# EAGLE design LampSchematic_movergb (EAGLE 7.3.0)
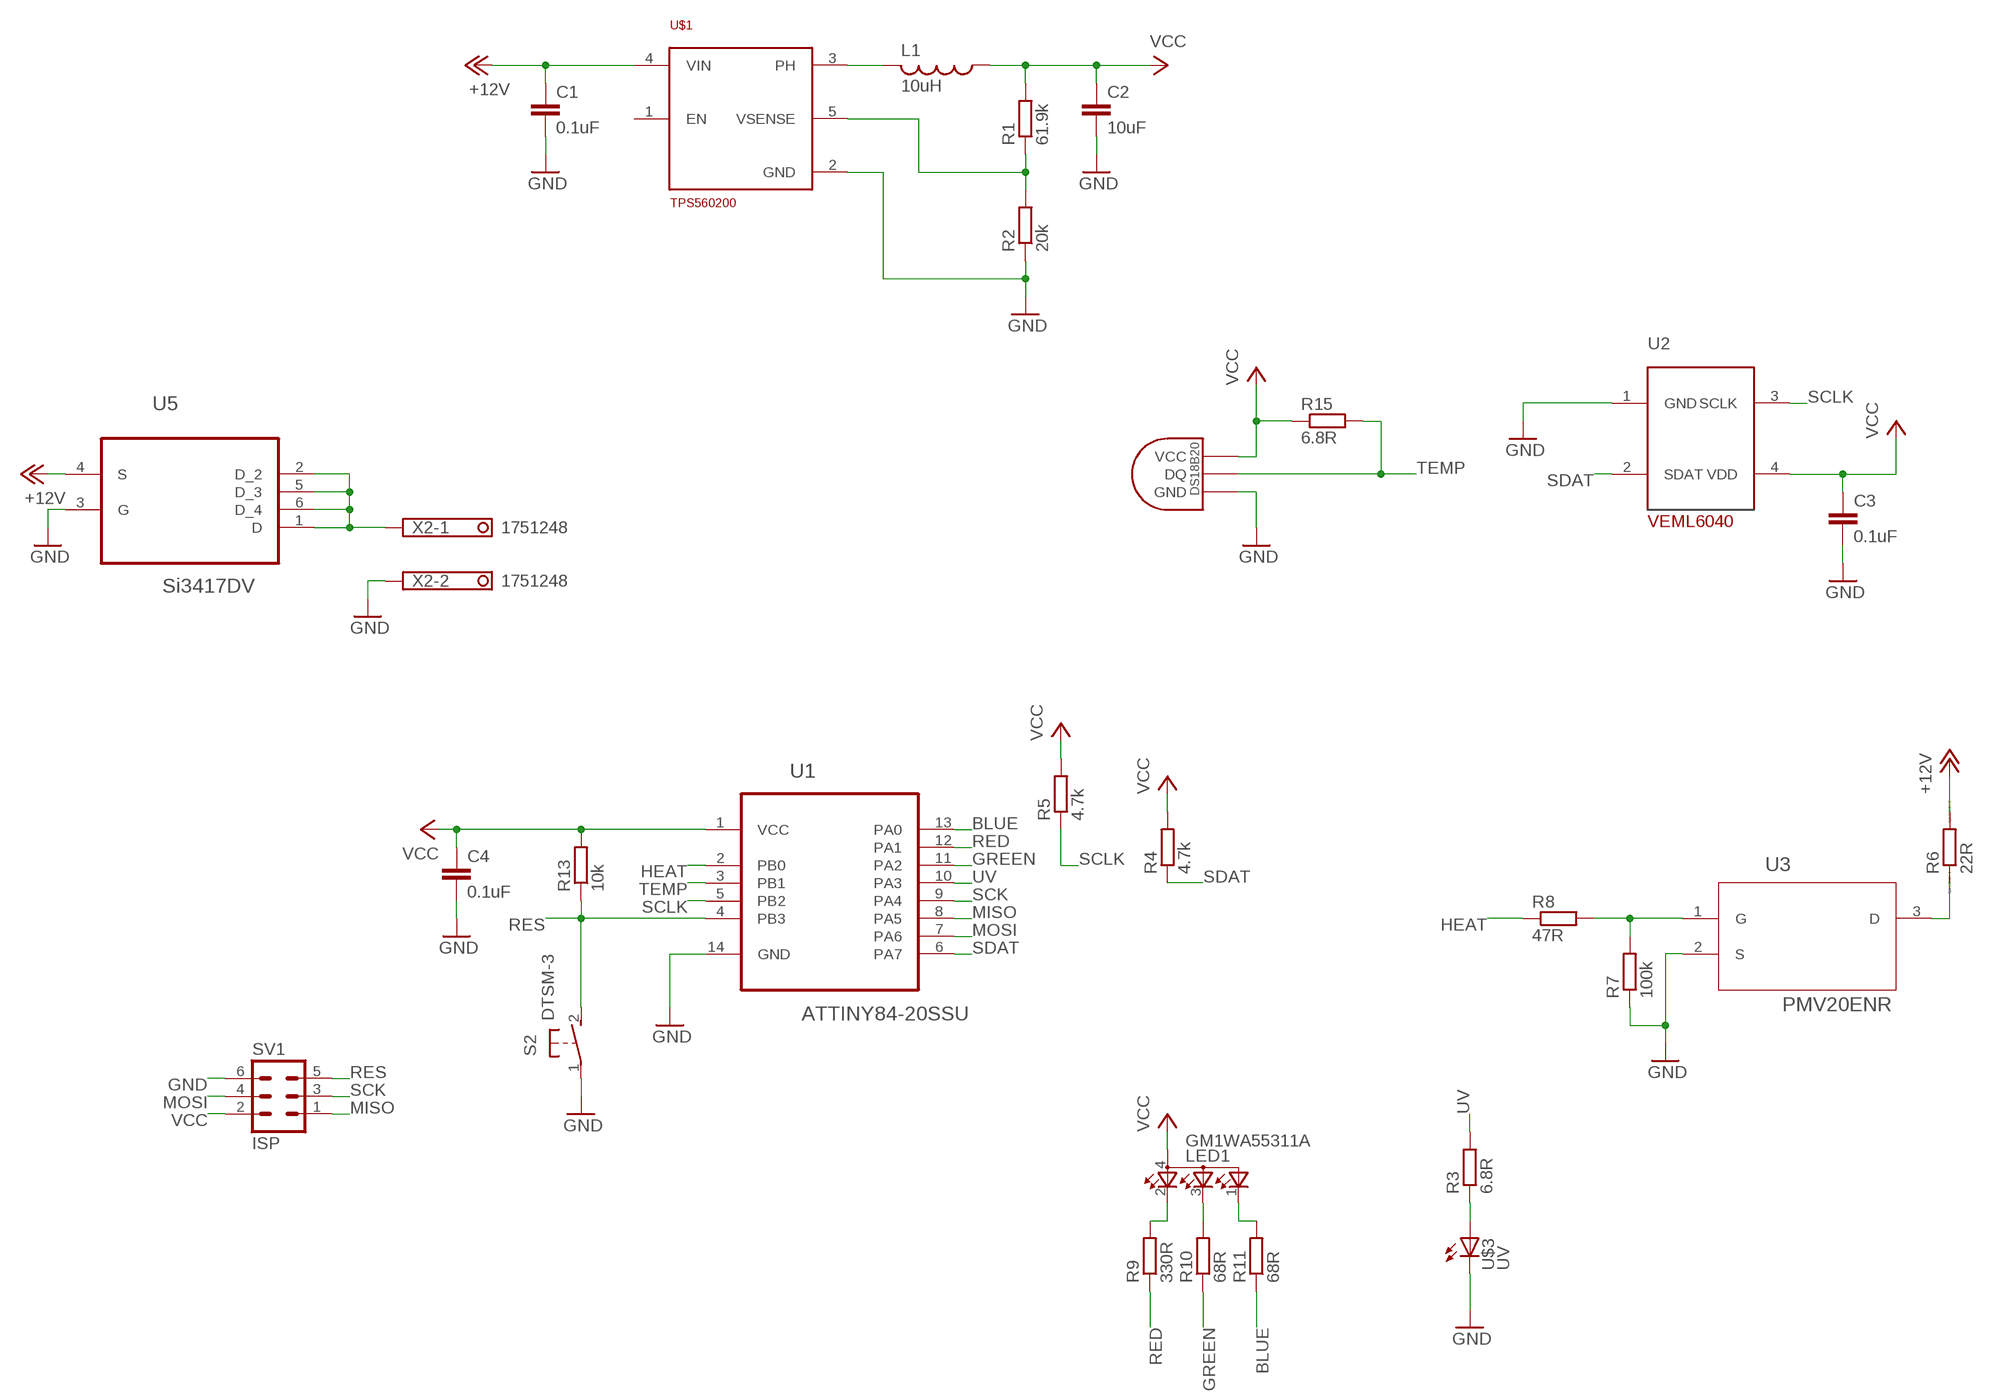
[diagram p0: schematic, sheet 1]

## Parts
C1  0.1uF  C-EUC0805  [C0805]
C2  10uF  C-EUC0805  [C0805]
C3  0.1uF  C-EUC0805  [C0805]
C4  0.1uF  C-EUC0805  [C0805]
L1  10uH  L-USL2012C  [L2012C]
LED1  GM1WA55311A  [GM1WA55311A]
R1  61.9k  R-EU_R0805  [R0805]
R2  20k  R-EU_R0805  [R0805]
R3  6.8R  R-EU_R0805  [R0805]
R4  4.7k  R-EU_R0805  [R0805]
R5  4.7k  R-EU_R0805  [R0805]
R6  22R  R  [5WRESISTOR]
R7  100k  R-EU_R0805  [R0805]
R8  47R  R-EU_R0805  [R0805]
R9  330R  R-EU_R0805  [R0805]
R10  68R  R-EU_R0805  [R0805]
R11  68R  R-EU_R0805  [R0805]
R13  10k  R-EU_R0805  [R0805]
R15  6.8R  R-EU_R0805  [R0805]
S2  DTSM-3  [DTSM-3]
SV1  ISP  MA03-2  [MA03-2]
U1  ATTINY84-20SSU  [SOIC127P600X175-14N]
U2  VEML6040  [VEML6040]
U3  PMV20ENR  [SOT95P230X110-3N]
U5  Si3417DV  SI3417DV-T1-GE3  [SOP95P285X110-6N]
U$1  TPS560200  [SOT23-5L]
U$2  DS1820TO92  [DS1820]
U$3  UV  [GM5BW96385A]
X2  1751248  [1751248]

## Nets
+12V: C1.1 R6.P$2 U5.4(S) U$1.4(VIN)
BLUE: R11.1 U1.13(PA0)
GND: C1.2 C2.2 C3.2 C4.2 R2.1 R7.1 S2.1 SV1.6 U1.14(GND) U2.1(GND) U3.2(S) U5.3(G) U$1.2(GND) U$2.GND U$3.2 X2.2
GREEN: R10.1 U1.11(PA2)
HEAT: R8.1 U1.2(PB0)
MISO: SV1.1 U1.8(PA5)
MOSI: SV1.4 U1.7(PA6)
N$1: L1.2 U$1.3(PH)
N$2: R1.1 R2.2 U$1.5(VSENSE)
N$4: R6.P$1 U3.3(D)
N$5: R7.2 R8.2 U3.1(G)
N$6: LED1.2(CRED) R9.2
N$7: LED1.3(CBLUE) R10.2
N$8: LED1.1(CGREEN) R11.2
N$9: R3.1 U$3.1
N$11: U5.1(D) U5.2(D_2) U5.5(D_3) U5.6(D_4) X2.1
RED: R9.1 U1.12(PA1)
RES: R13.1 S2.2 SV1.5 U1.4(PB3)
SCK: SV1.3 U1.9(PA4)
SCLK: R5.1 U1.5(PB2) U2.3(SCLK)
SDAT: R4.1 U1.6(PA7) U2.2(SDAT)
TEMP: R15.2 U1.3(PB1) U$2.DQ
UV: R3.2 U1.10(PA3)
VCC: C2.1 C3.1 C4.1 L1.1 LED1.4(A) R1.2 R4.2 R5.2 R13.2 R15.1 SV1.2 U1.1(VCC) U2.4(VDD) U$2.VDD(VCC)
Unconnected: U$1.1(EN)

## Library data of the parts
C1-C4 = resistor:C-EU: CAPACITOR, European symbol
L1 = resistor:L-US: INDUCTOR, American symbol
LED1 = MyParts:GM1WA55311A: Chip LED RGB Source: http://document.sharpsma.com/files/GM1WA55311A_SS.pdf
R1-R5 R7-R11 R13 R15 = resistor:R-EU_: RESISTOR, European symbol
R6 = MyParts:R
S2 = switch-tact:DTSM-3
SV1 = con-lstb:MA03-2: PIN HEADER; OC_FARNELL: unknown; OC_NEWARK: unknown
U1 = Atmel_By_element14_Batch_1-00:ATTINY84-20SSU: 8-bit Microcontroller with Bytes In-System Programmable Flash; MPN: ATTINY84-20SSU; OC_FARNELL: 1636955; OC_NEWARK: 03P2040; PACKAGE: SOIC-14; SUPPLIER: Atmel
U2 = MyParts:VEML6040: VEML6040 Selectable maximum detection range (360, 721, 1442, 2883, 5767, or 11 796) lux with highest sensitivity 0.0056 lux/step. Temperature compensation: -40 °C to +85 °C Operation voltage: 2.5 V to 3.6 V.
U3 = MyParts:PMV20ENR
U5 = MyParts:SI3417DV-T1-GE3: Id - Continuous Drain Current: 8 A Vds - Drain-Source Breakdown Voltage: - 30 V Rds On - Drain-Source Resistance: 30 mOhms Transistor Polarity: P-Channel Vgs - Gate-Source Breakdown Voltage: 20 V
U$1 = MyParts:TPS560200
U$2 = Ava:DS1820: DS18B20 Programmable Resolution 1-Wire Digital Thermometer Description The DS18B20 digital thermometer provides 9-bit to 12-bit Celsius temperature measurements and has an alarm function with nonvolatile user-programmable upper and lower trigger points. The DS18B20 communicates over a 1-Wire® bus that by definition requires only one data line (and ground) for communication with a central microprocessor. It has an operating temperature range of -55°C to +125°C and is accurate to ±0.5°C over the range of -10°C to +85°C. In addition, the DS18B20 can derive power directly from the data line ("parasite power"), eliminating the need for an external power supply. Each DS18B20 has a unique 64-bit serial code, which allows multiple DS18B20s to function on the same 1-Wire bus. Thus, it is simple to use one microprocessor to control many DS18B20s distributed over a large area. Applications that can benefit from this feature include HVAC environmental controls, temperature monitoring systems inside buildings, equipment, or machinery, and process monitoring and control systems.
U$3 = MyParts:UV
X2 = con-phoenix-350:1751248: MKDS 1/ 2-3,5 Printklemme Nennstrom: 10 A Bemessungsspannung: 160 V Raster: 3,5 mm Polzahl: 2 Montageart: Löten Anschlussart: Schraubanschluss Anschlussrichtung vom Leiter zur Platine: 0° Source: http://eshop.phoenixcontact.com .. 1751248.pdf; OC_FARNELL: unknown; OC_NEWARK: unknown

## Board
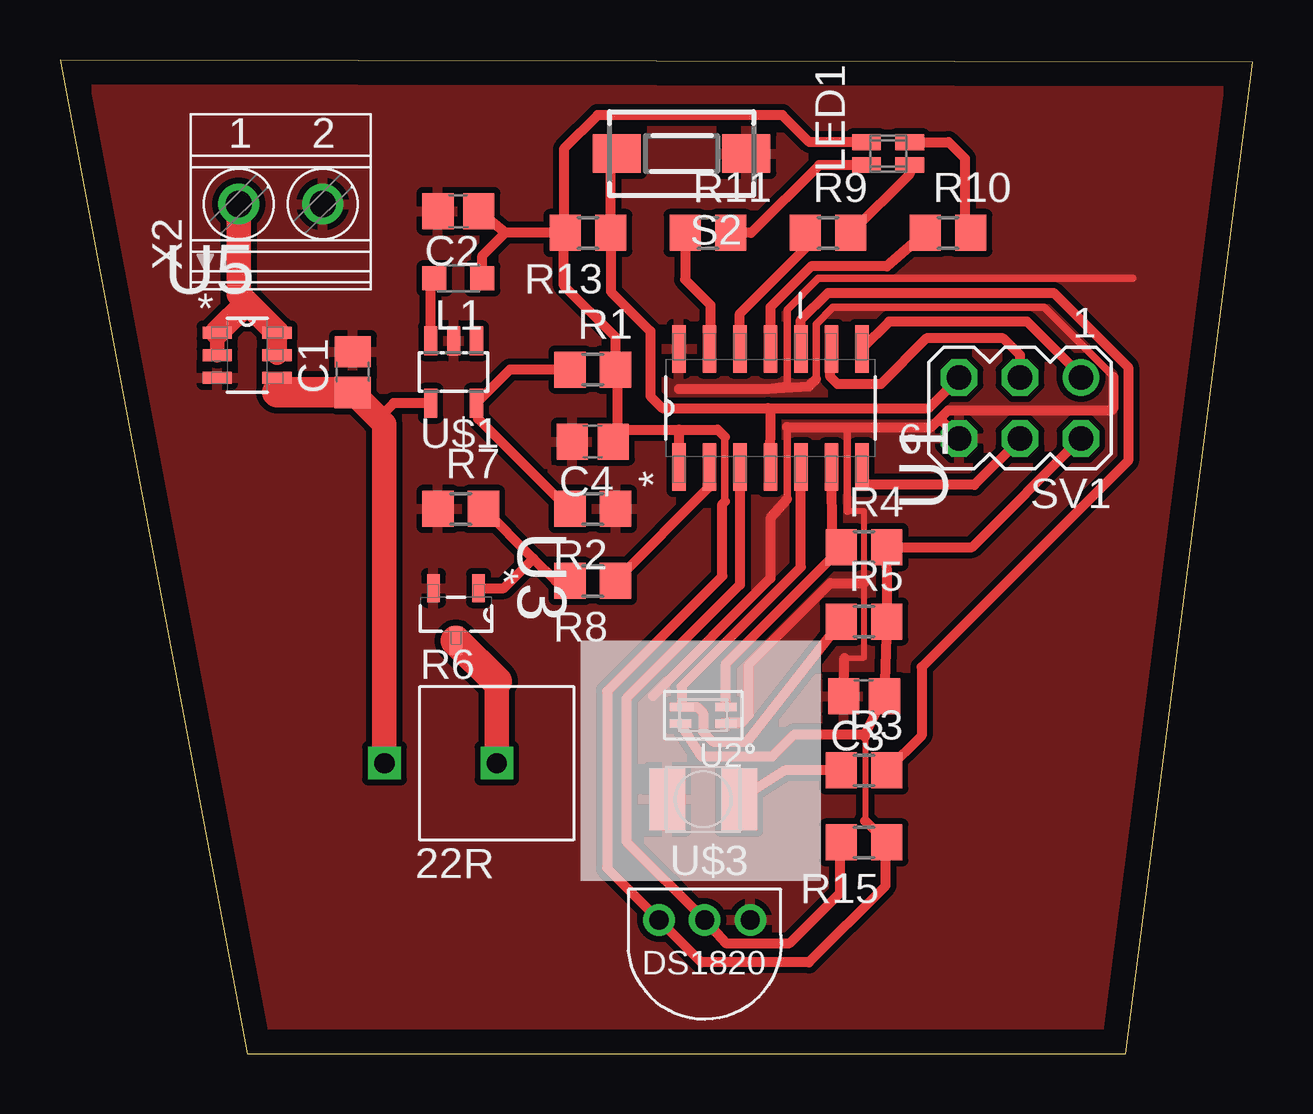
[diagram p1: board, top side]

Size 49.7 x 41.4 mm. Coordinates in mm from the lower left corner, seen from the top.
Outline: 7.8,0 44.4,0 49.7,41.3 0,41.4 7.8,0
Copper layers (1*16): Top 0.035mm / dielectric 1.5mm / Bottom 0.035mm
Design rules "default": minimum track width 10mil, minimum drill 24mil, track to track 8mil, track to pad 8mil, pad to pad 8mil, via to via 8mil, smd to smd 8mil, copper to edge 40mil, drill to drill 8mil, minimum pad ring 10mil, minimum via ring 8mil, stop-mask expansion 4mil, vias tented up to drill 0mil, thermal gap 10mil

### Footprints (pad centres in the part's own frame; a part is rotated, then mirrored left to right if it is on the bottom)
C0805 = smd 1.3 x 1.5: 1 -0.85,0; 2 0.85,0
L2012C = smd 1 x 1: 1 -1,0; 2 1,0
GM1WA55311A = smd 0.65 x 1.2: 1 -0.475,0.9; 2 -0.475,-0.9; 3 0.475,-0.9; 4 0.475,0.9
R0805 = smd 1.3 x 1.5: 1 -0.95,0; 2 0.95,0
5WRESISTOR = drill 0.85 square: P$1 0,0; P$2 -4.68,0
DTSM-3 = smd 2 x 1.6: 1 -2.7,0; 2 2.7,0
MA03-2 = drill 1.016: 1 -2.54,-1.27 | drill 1.016 octagon: 2 -2.54,1.27; 3 0,-1.27; 4 0,1.27; 5 2.54,-1.27; 6 2.54,1.27
SOIC127P600X175-14N = smd 1.981 x 0.559: 1 -2.464,3.81; 2 -2.464,2.54; 3 -2.464,1.27; 4 -2.464,0; 5 -2.464,-1.27; 6 -2.464,-2.54; 7 -2.464,-3.81; 8 2.464,-3.81; 9 2.464,-2.54; 10 2.464,-1.27; 11 2.464,0; 12 2.464,1.27; 13 2.464,2.54; 14 2.464,3.81
VEML6040 = smd 0.9 x 0.35: 1 -0.95,0.35; 2 -0.95,-0.35; 4 0.95,0.35 | smd 1 x 0.35: 3 0.9,-0.35
SOT95P230X110-3N = smd 1.168 x 0.533: 1 -1.092,0.94; 2 -1.092,-0.94; 3 1.092,0
SOP95P285X110-6N = smd 1.219 x 0.508: 1 -1.245,0.94; 2 -1.245,0; 3 -1.245,-0.94; 4 1.245,-0.94; 5 1.245,0; 6 1.245,0.94
SOT23-5L = smd 0.55 x 1.2: 1 -0.95,-1.3; 2 0,-1.3; 3 0.95,-1.3; 4 0.95,1.3; 5 -0.95,1.3
DS1820 = drill 0.8: DQ 2.54,-1.27; GND 0.635,-1.27; VDD 4.445,-1.27
GM5BW96385A = smd 1.5 x 2.6: 1 -1.5,0; 2 1.5,0
1751248 = drill 1.1 pad 1.7: 1 -1.75,-0.1; 2 1.75,-0.1

### Placement (x,y rotation side)
C1  12.2,28.4 90 top
C2  16.6,35.1 180 top
C3  33.5,14.9 180 top
C4  22.2,25.5 180 top
L1  16.6,32.3 180 top
LED1  34.5,37.5 90 top
R1  22.2,28.5 0 top
R2  22.2,22.7 180 top
R3  33.5,11.8 0 top
R4  33.5,21.1 0 top
R5  33.5,18 0 top
R6  18.2,12.1 0 top
R7  16.7,22.7 0 top
R8  22.2,19.7 180 top
R9  32,34.2 0 top
R10  37,34.2 0 top
R11  27,34.2 0 top
R13  22,34.2 180 top
R15  33.5,8.8 180 top
S2  25.9,37.5 180 top
SV1  40,26.9 180 top
U1  29.6,26.9 90 top
U2  26.8,14.1 180 top
U3  16.5,18.3 270 top
U5  7.8,29.1 0 top
U$1  16.4,28.4 180 top
U$2  29.4,4.3 180 top
U$3  26.8,10.6 180 top
X2  9.2,35.5 0 top

### Tracks (layer width: path | path; a pad name or v marks a point on that pad's centre or on a via)
+12V
  Top 0.406: 9.05,27.55 U5.4 | U$1.4 13.9,27.1 13.28,26.48
  Top 1.016: R6.P$2 13.52,26.23 13.28,26.48 C1.1
  Top 1.27: C1.1 9.05,27.55
BLUE
  Top 0.406: R11.1 26.05,32.25 27.1,31.2 27.1,29.4 U1.13
GND
  Top 0.254: 32.8,22.6 33.5,22.6 33.5,19.6 33.5,16.5 32.68,16.48
  Top 0.305: 30.3,27.8 30.3,31 31.6,32.3 44.7,32.3 | 30.3,23.1 30.3,26.1 | 32.8,22.6 32.8,26 | 31.5,28.1 31.5,30.4 32.2,31.1 41,31.1 43.9,28.2
  Top 0.406: 25.8,27.7 29.5,27.7 | 29.5,27.7 30.3,27.8 | C3.2 32.68,16.48 | 29.5,27.7 31.2,27.8 31.5,28.1 | 30.3,26.1 36.3,26.1 36.75,26.55 | 36.75,26.55 37,26.8 43.8,26.8 43.9,26.9 43.9,28.2 | 30.3,23.1 29.6,22.3 29.6,19.8 24.7,14.9 | U2.1 27.8,13.8 28.4,13.8 28.7,14.1 28.7,16.2 32.1,19.6 33.5,19.6 | SV1.6 36.75,26.34 36.75,26.55
  pour Top (isolate 0.254): 0.3,44.8 1.2,-6.8 62.4,-7.1 58.6,47.4
GREEN
  Top 0.406: R10.1 34.45,32.8 31.3,32.8 29.6,31.1 U1.11
HEAT
  Top 0.406: U1.2 27.06,23.61 R8.1
MISO
  Top 0.406: SV1.1 42.54,28.26 40.3,30.5 34.55,30.5 U1.8
MOSI
  Top 0.406: SV1.4 40,25.6 38.1,23.7 33.5,23.7 33.4,23.8 33.4,24.43 U1.7
N$1
  Top 0.406: U$1.3 15.45,32.15 L1.2
N$2
  Top 0.406: R1.1 18.75,28.5 U$1.5 17.42,26.45 21.17,22.7 R2.2
N$4
  Top 1.016: R6.P$1 18.2,15.51
  Top 1.27: 18.2,15.51 U3.3
N$5
  Top 0.406: R8.2 20.65,19.7 19.72,20.62 | 19.72,20.62 R7.2 | U3.1 18.49,19.39 19.72,20.62
N$6
  Top 0.406: LED1.2 35.4,36.65 R9.2
N$7
  Top 0.406: LED1.3 37.03,37.98 37.7,37.3 37.7,34.25 R10.2
N$8
  Top 0.406: LED1.1 31.62,37.02 28.8,34.2 R11.2
N$9
  Top 0.406: 28.6,9.5 U$3.1 30.2,11.8 R3.1
N$11
  Top 0.406: U5.1 6.55,30.05
  Top 0.61: U5.2 U5.1
  Top 0.813: U5.5 U5.6
  Top 1.016: X2.1 7.45,31.63 7.79,31.29 | 7.79,31.29 U5.6 | 6.55,30.05 7.79,31.29
RED
  Top 0.406: U1.12 28.33,30.83 31.1,33.6 31.1,34.15 R9.1
RES
  Top 0.406: 29.5,26.9 25.1,26.9 24.6,27.4 24.6,30.1 22.95,31.75 R13.1 22.95,37.25 S2.2 | U1.4 29.61,26.71 29.5,26.9 | 29.5,26.9 36.19,26.9 SV1.5
SCK
  Top 0.406: SV1.3 40,29.1 39.3,29.8 36.1,29.8 34.2,27.9 32.4,27.9 32.1,28.2 32.1,29.32 U1.9
SCLK
  Top 0.406: R5.1 28.64,13 27.2,13 26.8,13.4 26.8,14.2 26.55,14.45 U2.3 25.9,15.3 30.87,20.27 U1.5
SDAT
  Top 0.406: U1.6 32.15,21.34 R4.1 32.55,21.05 27.75,16.25 U2.2
TEMP
  Top 0.406: U1.3 28.33,19.53 23.6,14.8 23.6,8.83 U$2.DQ 27.73,4.6 30.4,4.6 32.5,6.7 32.5,8.75 R15.2
UV
  Top 0.406: U1.10 30.87,30.57 32,31.7 41.4,31.7 44.5,28.6 44.5,24.7 35.9,16.1 35.9,13.25 R3.2
VCC
  Top 0.254: 33.55,13.3 33.55,13.2 33.55,9.7
  Top 0.305: 27.7,25.7 27.7,23
  Top 0.406: 42.58,25.58 SV1.2 38.01,21.1 R4.2 34.47,19.36 R5.2 C3.1 33.55,13.3 | 27.7,25.7 27.4,26 25.8,26 | U2.4 26.72,12.38 29.68,12.38 30.6,13.3 33.45,13.3 33.55,13.2 | 23.23,25.79 C4.1 | R13.2 18.55,34.2 | 18.55,34.2 C2.1 | U1.1 25.8,26 | 23.23,25.79 23.34,26 25.8,26 | 23.23,25.79 23.23,28.48 R1.2 23.15,29.85 21,32 21,34.15 R13.2 | LED1.4 31.22,37.98 30.1,39.1 22.4,39.1 21,37.7 21,34.25 R13.2 | L1.1 17.6,33.25 18.55,34.2 | 33.55,9.7 R15.1 34.4,8.75 34.4,7 31.2,3.8 26.72,3.8 U$2.VDD 22.8,7.72 22.8,15.1 27.6,19.9 27.6,22.9 27.7,23